# EAGLE design tejesh (EAGLE 8.6.0)
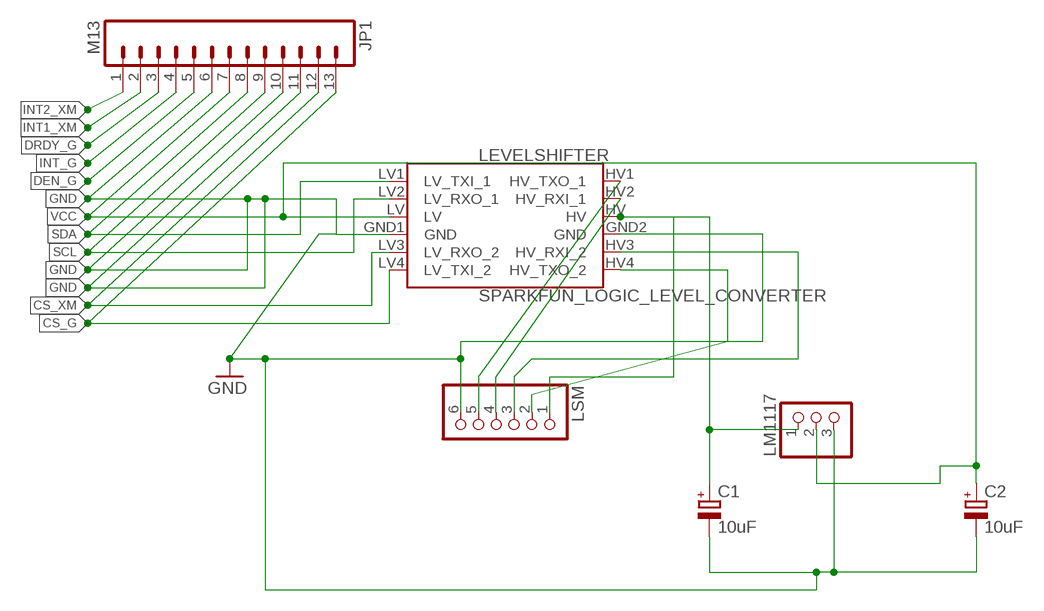
[diagram p0: schematic, sheet 1]

## Parts
C1  10uF  CPOL-EUE2.5-6  [E2,5-6]
C2  10uF  CPOL-EUE2.5-6  [E2,5-6]
JP1  M13  [1X13]
LEVELSHIFTER  SPARKFUN_LOGIC_LEVEL_CONVERTER  [SPARKFUN_LOGIC_LEVEL_CONVERTER]
LM1117  PINHD-1X3  [1X03]
LSM  PINHD-1X6  [1X06]

## Nets
CS_G: JP1.13 LEVELSHIFTER.LV4(LV_TXI_2)
CS_XM: JP1.12 LEVELSHIFTER.LV3(LV_RXO_2)
DEN_G: JP1.5
DRDY_G: JP1.3
GND: C1.- C2.- JP1.6 JP1.10 JP1.11 LEVELSHIFTER.GND1(GND) LEVELSHIFTER.GND2(GND) LM1117.3 LSM.6
INT1_XM: JP1.2
INT2_XM: JP1.1
INT_G: JP1.4
N$2: C1.+ LEVELSHIFTER.HV LM1117.1 LSM.1
N$3: LEVELSHIFTER.HV1(HV_TXO_1) LSM.5
N$5: LEVELSHIFTER.HV2(HV_RXI_1) LSM.4
N$6: LEVELSHIFTER.HV3(HV_RXI_2) LSM.3
N$7: LEVELSHIFTER.HV4(HV_TXO_2) LSM.2
SCL: JP1.9 LEVELSHIFTER.LV2(LV_RXO_1)
SDA: JP1.8 LEVELSHIFTER.LV1(LV_TXI_1)
VCC: C2.+ JP1.7 LEVELSHIFTER.LV LM1117.2

## Library data of the parts
C1 C2 = resistor:CPOL-EU: POLARIZED CAPACITOR, European symbol
JP1 = SparkFun-Connectors:M13: 13-pin single row .1" header
LEVELSHIFTER = SparkFun-Boards:SPARKFUN_LOGIC_LEVEL_CONVERTER: SparkFun Logic Level Converter -Bi-Directional This is the mechnical outline for the 3.3V - 5V bi directional logic level converter. *Note, the "LOCK" Package has the header pins staggered by an offset of 5 mils (off center line), so that when you slide a row of standard 0.1" headers into the PTH pads, it will hold position vertically. See the follwing turorial for more information on this type of special footprints: Sneaky Footprints <https://www.sparkfun.com/tutorials/114> SparkFun Products: SparkFun Logic Level Converter - Bi-Directional <https://www.sparkfun.com/products/12009>
LM1117 = pinhead:PINHD-1X3: PIN HEADER
LSM = pinhead:PINHD-1X6: PIN HEADER

## Board
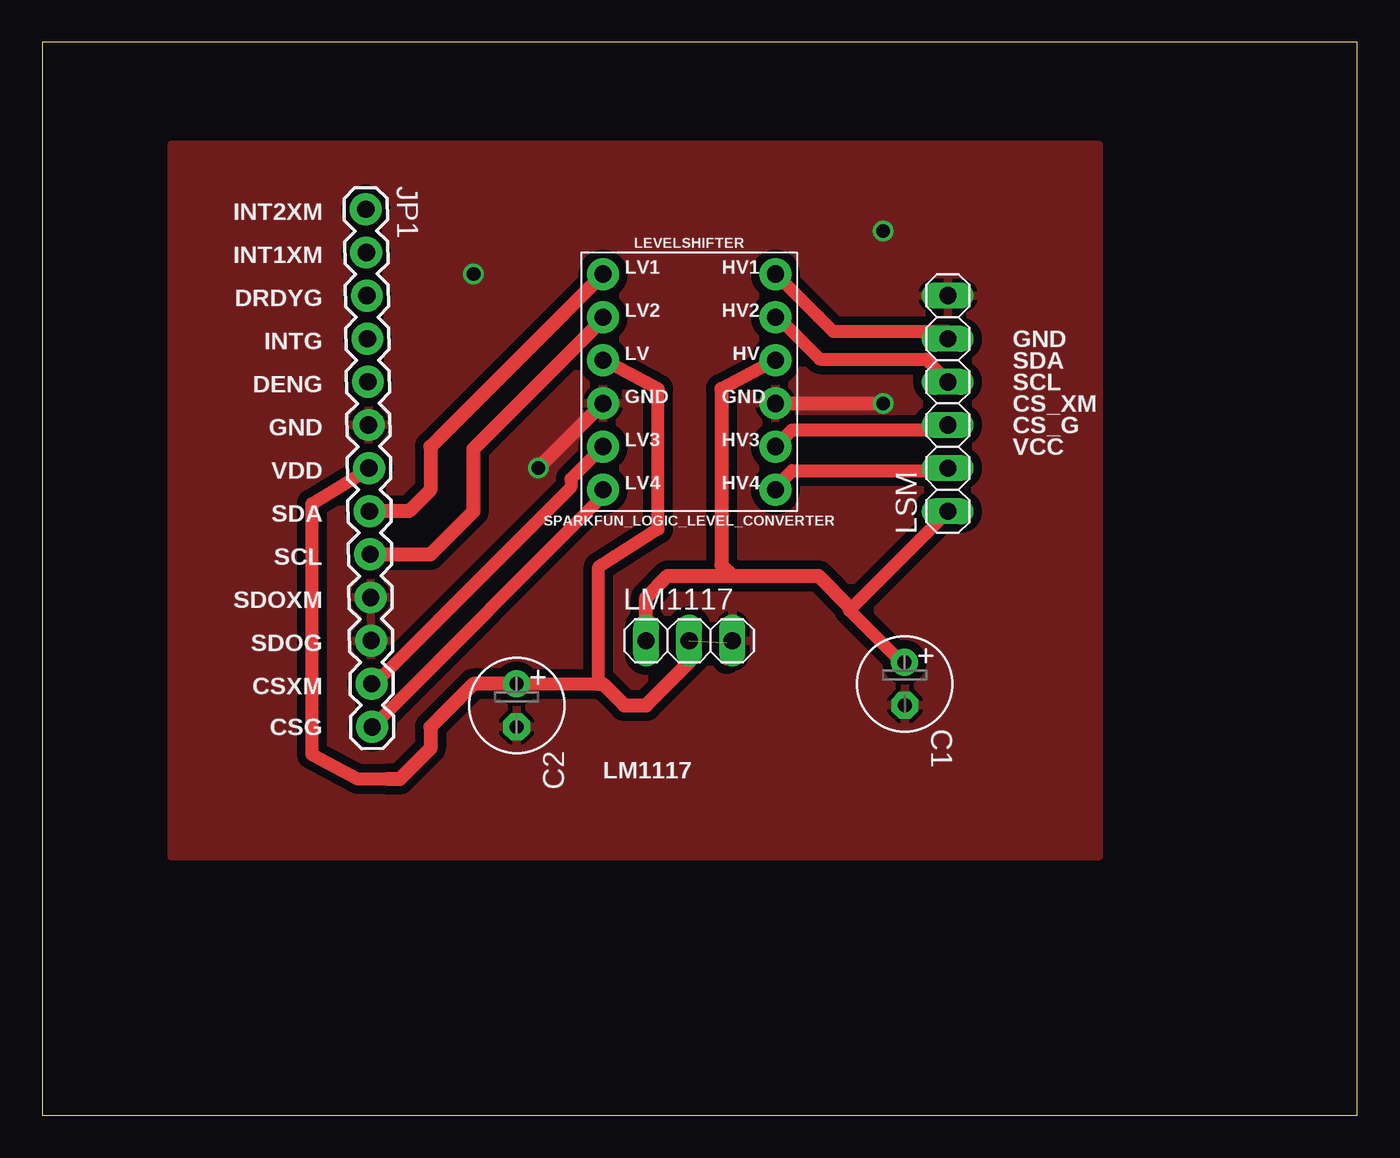
[diagram p1: board, top side]
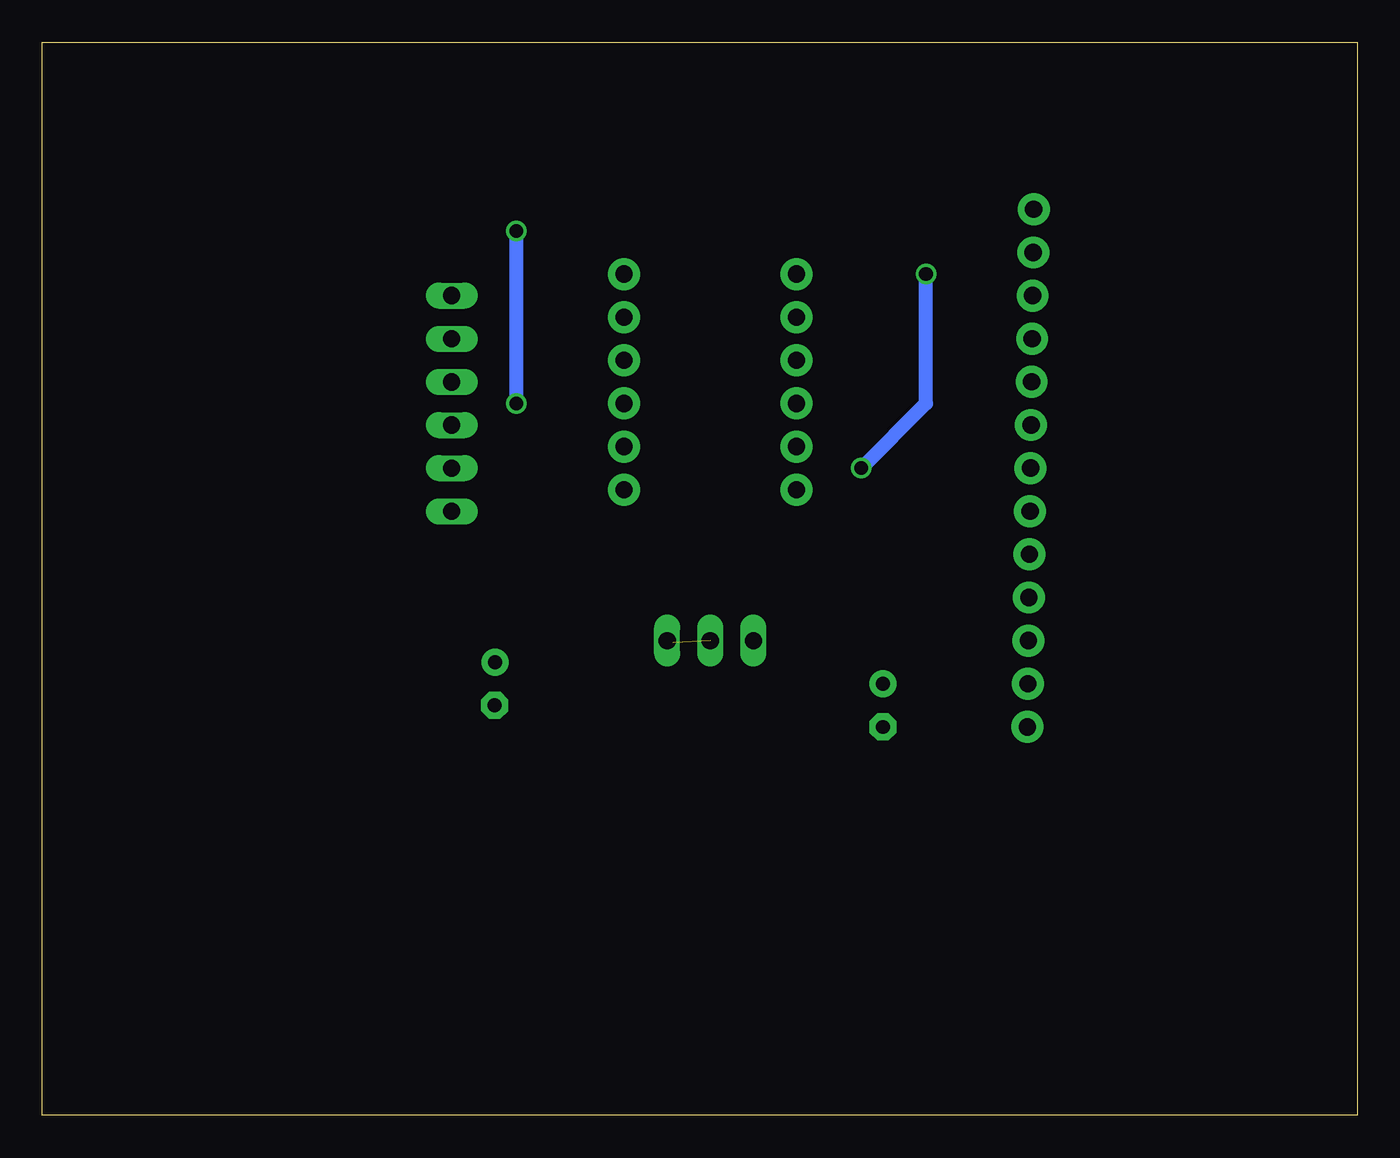
[diagram p2: board, bottom side, seen from below]

Size 77.45 x 63.17 mm. Coordinates in mm from the lower left corner, seen from the top.
Outline: 0,0 77.45,0 77.45,63.17 0,63.17 0,0
Copper layers (1*16): Top 0.035mm / dielectric 1.5mm / Bottom 0.035mm
Design rules "default *": minimum track width 30mil, minimum drill 0.35mm, track to track 8mil, track to pad 14mil, pad to pad 6mil, via to via 6mil, smd to smd 6mil, copper to edge 40mil, drill to drill 6mil, minimum pad ring 10mil, minimum via ring 8mil, stop-mask expansion 4mil, vias tented up to drill 0mil, thermal gap 10mil

### Footprints (pad centres in the part's own frame; a part is rotated, then mirrored left to right if it is on the bottom)
E2,5-6 = drill 0.813 pad 1.6: + -1.27,0 | drill 0.813 pad 1.6 octagon: - 1.27,0
1X13 = drill 1.016 pad 1.88: 1 0,0; 2 2.54,0; 3 5.08,0; 4 7.62,0; 5 10.16,0; 6 12.7,0; 7 15.24,0; 8 17.78,0; 9 20.32,0; 10 22.86,0; 11 25.4,0; 12 27.94,0; 13 30.48,0
SPARKFUN_LOGIC_LEVEL_CONVERTER = drill 1.016 pad 1.88: GND1 -5.08,-1.27; GND2 5.08,-1.27; HV 5.08,1.27; HV1 5.08,6.35; HV2 5.08,3.81; HV3 5.08,-3.81; HV4 5.08,-6.35; LV -5.08,1.27; LV1 -5.08,6.35; LV2 -5.08,3.81; LV3 -5.08,-3.81; LV4 -5.08,-6.35
1X03 = drill 1.016 long: 1 -2.54,0; 2 0,0; 3 2.54,0
1X06 = drill 1.016 long: 1 -6.35,0; 2 -3.81,0; 3 -1.27,0; 4 1.27,0; 5 3.81,0; 6 6.35,0

### Placement (x,y rotation side)
C1  50.8,25.4 270.4 top
C2  27.94,24.13 270 top
JP1  19.05,53.34 270.7 top
LEVELSHIFTER  38.1,43.18 0 top
LM1117  38.1,27.94 0 top
LSM  53.34,41.91 90 top

### Tracks (layer width: path | path; a pad name or v marks a point on that pad's centre or on a via)
CS_G
  Top 0.762: JP1.13 19.56,22.99 33.07,36.5 LEVELSHIFTER.LV4
CS_XM
  Top 0.762: JP1.12 19.56,25.88 20.04,25.88 31.14,36.98 31.14,37.47 32.59,38.91 LEVELSHIFTER.LV3
GND  (via drill 0.8 pad 1)
  Top 0.813: LEVELSHIFTER.GND2 v49.53,41.91 | LEVELSHIFTER.GND1 v29.21,38.1
  Bottom 0.813: v49.53,41.91 v49.53,52.07 | v29.21,38.1 25.4,41.91 v25.4,49.53
  pour Top (isolate 0.5): 7.62,57.15 62.23,57.15 62.23,15.24 7.62,15.24
N$2
  Top 0.762: C1.+ 50.44,26.85 47.55,29.74 53.34,35.54 LSM.1 | 40,42.77 42.72,44.22 LEVELSHIFTER.HV
  Top 0.813: LM1117.1 35.56,30.48 36.83,31.75 40.64,31.75 | 40.64,31.75 45.72,31.75 47.55,29.92 47.55,29.74 | 40,42.77 40,32.38 40.64,31.75
N$3
  Top 0.762: LSM.5 53.34,46.15 46.58,46.15 45.73,47 43.2,49.53 LEVELSHIFTER.HV1
N$5
  Top 0.762: LSM.4 52.07,44.53 45.8,44.53 43.2,47.12 LEVELSHIFTER.HV2
N$6
  Top 0.762: LEVELSHIFTER.HV3 44.17,40.36 53.34,40.36 LSM.3
N$7
  Top 0.762: LSM.2 53.34,37.95 44.17,37.95 43.2,36.98 LEVELSHIFTER.HV4
SCL
  Top 0.813: JP1.9 22.86,33.02 25.4,35.56 25.4,39.24 33.02,46.86 LEVELSHIFTER.LV2
SDA
  Top 0.762: 19.56,36.02 JP1.8 | 33.07,49.53 LEVELSHIFTER.LV1
  Top 0.813: LEVELSHIFTER.LV1 22.86,39.37 22.86,36.83 21.59,35.56 JP1.8
VCC  (1 unrouted)
  Top 0.762: 40.31,26.85 40.31,27.81 | 20.32,19.79 18.59,19.79 15.87,21.23 15.87,36.02 19.07,37.95 JP1.7 | 27.76,25.4 C2.+ 32.77,25.4 32.77,32.28 36.27,34.52 36.27,42.77 33.55,44.22 33.07,44.22 LEVELSHIFTER.LV
  Top 0.813: C2.+ 25.4,25.4 22.86,22.86 22.86,21.59 21.06,19.79 20.32,19.79 | 32.77,25.4 33.02,25.4 34.29,24.13 35.56,24.13 38.1,26.67 LM1117.2

### Text on the board
tPlace: INT2XM | INT1XM | DRDYG | GND | INTG | SDA | DENG | SCL | CS_XM | CS_G | GND | VCC | VDD | SDA | SCL | SDOXM | SDOG | CSXM | CSG | LM1117